# Altium schematic sheet CherryPi.SchDoc
size A2; SheetNumber: 1; SheetTotal: 1
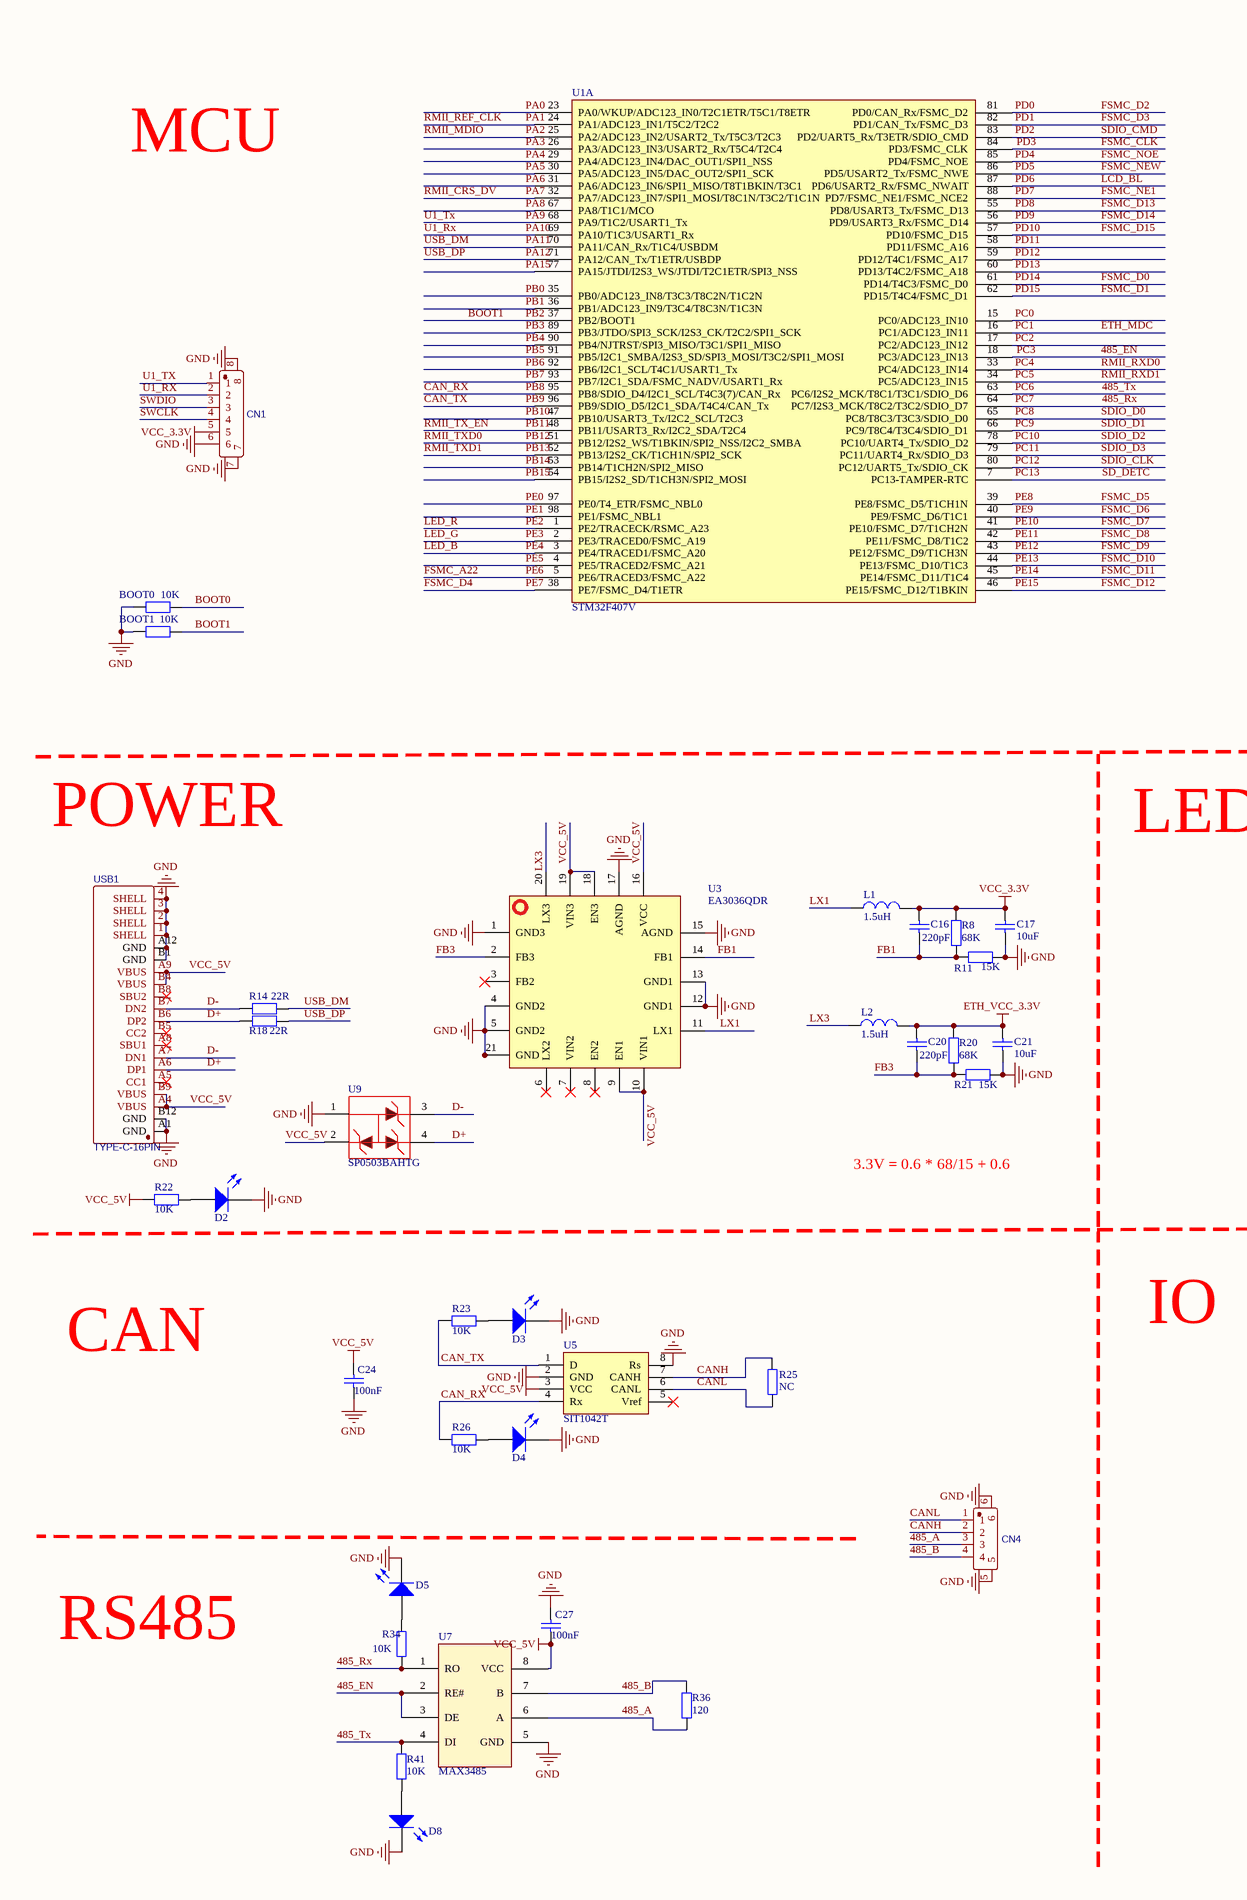
[diagram p0: CherryPi.SchDoc, left]
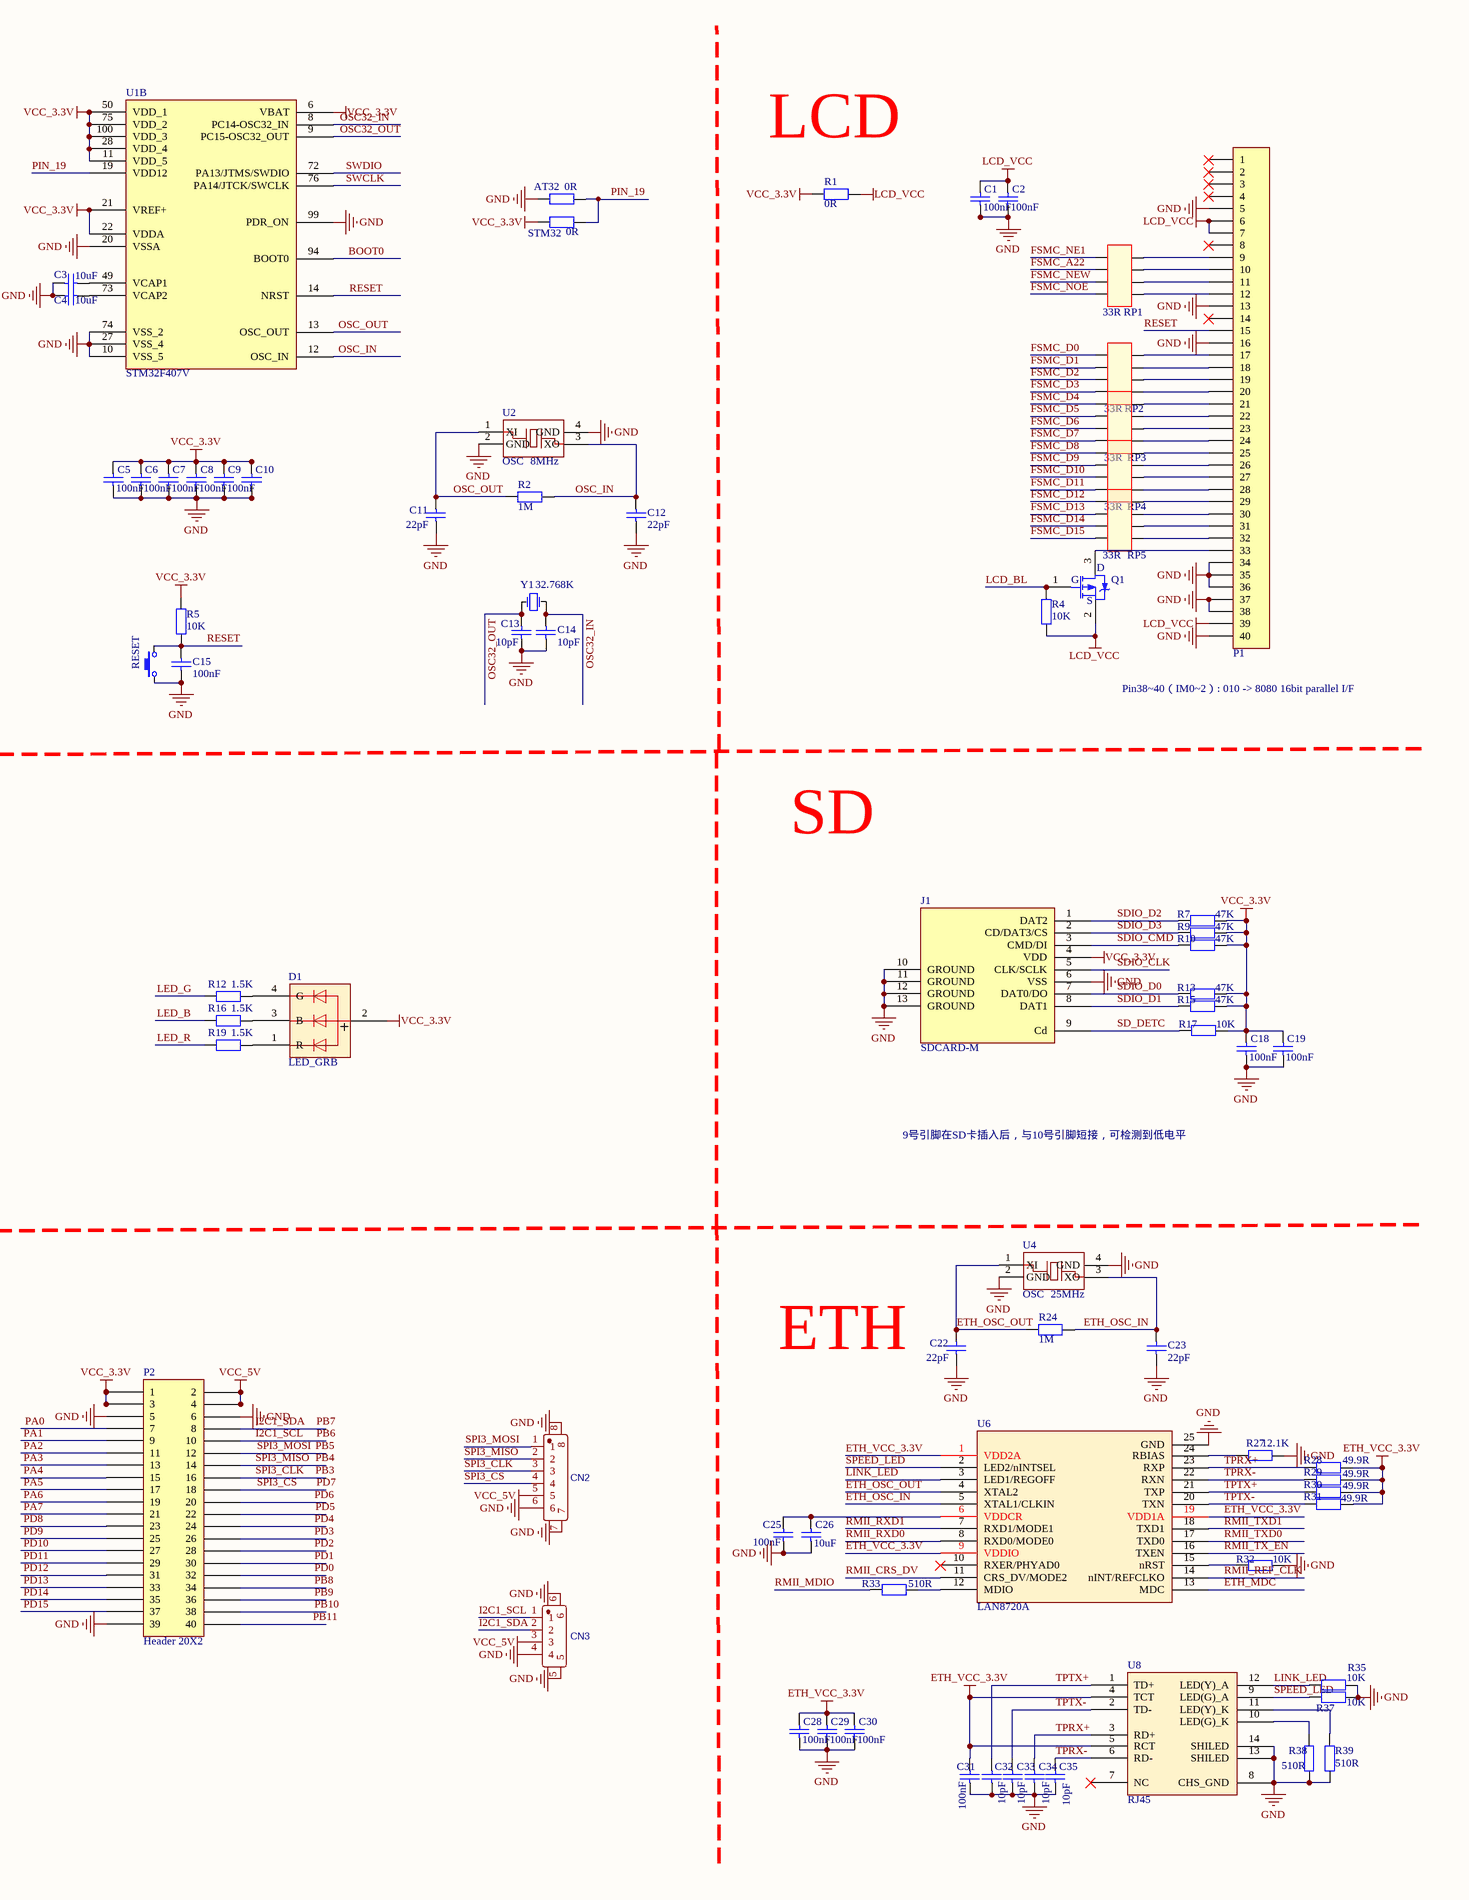
[diagram p1: CherryPi.SchDoc, right]

## Parts
AT32  value 0R  [0402_R - M]  (hidden comment: Res1)
BOOT0  value 10K  [0402_R - M]  (hidden comment: Res1)
BOOT1  value 10K  [0402_R - M]  (hidden comment: Res1)
C1  value 100nF  [0603_C]  (hidden comment: Cap)
C2  value 100nF  [0603_C]  (hidden comment: Cap)
C3  value 10uF  [0603_C]  (hidden comment: Cap)
C4  value 10uF  [0603_C]  (hidden comment: Cap)
C5  value 100nF  [0603_C]  (hidden comment: Cap)
C6  value 100nF  [0603_C]  (hidden comment: Cap)
C7  value 100nF  [0603_C]  (hidden comment: Cap)
C8  value 100nF  [0603_C]  (hidden comment: Cap)
C9  value 100nF  [0603_C]  (hidden comment: Cap)
C10  Cap  [0603_C]  (value not drawn)
C11  value 22pF  [0603_C]  (hidden comment: Cap)
C12  value 22pF  [0603_C]  (hidden comment: Cap)
C13  value 10pF  [0603_C]  (hidden comment: Cap)
C14  value 10pF  [0603_C]  (hidden comment: Cap)
C15  value 100nF  [0603_C]  (hidden comment: Cap)
C16  value 220pF  [0603_C]  (hidden comment: Cap)
C17  value 10uF  [0603_C]  (hidden comment: Cap)
C18  value 100nF  [0603_C]  (hidden comment: Cap)
C19  value 100nF  [0603_C]  (hidden comment: Cap)
C20  value 220pF  [0603_C]  (hidden comment: Cap)
C21  value 10uF  [0603_C]  (hidden comment: Cap)
C22  value 22pF  [0603_C]  (hidden comment: Cap)
C23  value 22pF  [0603_C]  (hidden comment: Cap)
C24  value 100nF  [0603_C]  (hidden comment: Cap)
C25  value 100nF  [0603_C]  (hidden comment: Cap)
C26  value 10uF  [0603_C]  (hidden comment: Cap)
C27  value 100nF  [0603_C]  (hidden comment: Cap)
C28  value 100nF  [0603_C]  (hidden comment: Cap)
C29  value 100nF  [0603_C]  (hidden comment: Cap)
C30  value 100nF  [0603_C]  (hidden comment: Cap)
C31  value 100nF  [0603_C]  (hidden comment: Cap)
C32  value 10pF  [0603_C]  (hidden comment: Cap)
C33  value 10pF  [0603_C]  (hidden comment: Cap)
C34  value 10pF  [0603_C]  (hidden comment: Cap)
C35  value 10pF  [0603_C]  (hidden comment: Cap)
CN1  WAFER-SH1.0-6PWB  [SH1.0_6P]  (value not drawn)
CN2  WAFER-SH1.0-6PWB  [SH1.0_6P]  (value not drawn)
CN3  HDGC1002WR-S-4P  [SH1.0_4P]  (value not drawn)
CN4  HDGC1002WR-S-4P  [SH1.0_4P]  (value not drawn)
D1  LED_GRB  [LED_RGB]
D2  LED0  [led-0603]  (value not drawn)
D3  LED0  [led-0603]  (value not drawn)
D4  LED0  [led-0603]  (value not drawn)
D5  LED0  [led-0603]  (value not drawn)
D8  LED0  [led-0603]  (value not drawn)
J1  SDCARD-M  [TF-SMD_503398-1892]
L1  value 1.5uH  [0805_L]  (hidden comment: Inductor)
L2  value 1.5uH  [0805_L]  (hidden comment: Inductor)
P1  Header 40  [FPC0.5 2H-WS-40P]  (value not drawn)
P2  Header 20X2  [HDR20X2_2.54]
Q1  MOSFET-P  [SOT-23]  (value not drawn)
R1  value 0R  [0603_R]  (hidden comment: Res1)
R2  value 1M  [0603_R]  (hidden comment: Res1)
R4  value 10K  [0603_R]  (hidden comment: Res1)
R5  value 10K  [0603_R]  (hidden comment: Res1)
R7  value 47K  [0603_R]  (hidden comment: Res1)
R8  value 68K  [0603_R]  (hidden comment: Res1)
R9  value 47K  [0603_R]  (hidden comment: Res1)
R10  value 47K  [0603_R]  (hidden comment: Res1)
R11  value 15K  [0603_R]  (hidden comment: Res1)
R12  value 1.5K  [0402_R - M]  (hidden comment: Res1)
R13  value 47K  [0603_R]  (hidden comment: Res1)
R14  value 22R  [0402_R - M]
R15  value 47K  [0603_R]  (hidden comment: Res1)
R16  value 1.5K  [0402_R - M]  (hidden comment: Res1)
R17  value 10K  [0603_R]  (hidden comment: Res1)
R18  value 22R  [0402_R - M]
R19  value 1.5K  [0402_R - M]  (hidden comment: Res1)
R20  value 68K  [0603_R]  (hidden comment: Res1)
R21  value 15K  [0603_R]  (hidden comment: Res1)
R22  value 10K  [0603_R]  (hidden comment: Res1)
R23  value 10K  [0603_R]
R24  value 1M  [0603_R]  (hidden comment: Res1)
R25  value NC  [0603_R]  (hidden comment: Res1)
R26  value 10K  [0603_R]
R27  value 12.1K  [0603_R]
R28  value 49.9R  [0603_R]
R29  value 49.9R  [0603_R]
R30  value 49.9R  [0603_R]
R31  value 49.9R  [0603_R]
R32  value 10K  [0603_R]
R33  value 510R  [0603_R]
R34  value 10K  [0603_R]
R35  value 10K  [0603_R]
R36  value 120  [0603_R]
R37  value 10K  [0603_R]
R38  value 510R  [0603_R]
R39  value 510R  [0603_R]
R41  value 10K  [0603_R]
RESET  TACT 2P  [SW-SMD_2*4]  (value not drawn)
RP1  33R  [0603_R(2x4)]
RP2  33R  [0603_R(2x4)]
RP3  33R  [0603_R(2x4)]
RP4  33R  [0603_R(2x4)]
RP5  33R  [0603_R(2x4)]
STM32  value 0R  [0402_R - M]  (hidden comment: Res1)
U1  STM32F407V  [LQFP-100_M]  (parts A,B of 2)
U2  OSC  [SMD_3225_4P]
U3  EA3036QDR  [QFN-20]
U4  OSC  [SMD_3225_4P]
U5  SIT1042T  [NSO8_N]
U6  LAN8720A  [QFN-24]
U7  MAX3485  [SOIC8_N]
U8  RJ45  [RJ45]
U9  SP0503BAHTG  [SOT_143]
USB1  TYPE-C-16PIN  [Type-C-16Pin]
Y1  value 32.768K  [SMD-3215]  (hidden comment: XTAL)

## Nets
ETH_VCC_3.3V: C20.2 C21.2 C28.1 C29.1 C30.1 C31.1 L2.2 R20.2 R28.1 R29.1 R30.1 R31.1 U6.1(VDD2A) U6.9(VDDIO) U6.19(VDD1A) U8.4(TCT) U8.5(RCT)
GND: AT32.2 BOOT0.1 BOOT1.1 C1.2 C2.2 C3.1 C4.1 C5.2 C6.2 C7.2 C8.2 C9.2 C10.2 C11.1 C12.1 C13.2 C14.1 C15.1 C17.1 C18.2 C19.2 C21.1 C22.1 C23.1 C24.2 C25.2 C26.2 C27.1 C28.2 C29.2 C30.2 C31.2 C32.2 C33.2 C34.2 C35.2 CN1.6 CN1.7 CN1.8 CN2.6 CN2.7 CN2.8 CN3.4 CN3.5 CN3.6 CN4.5 CN4.6 D2.2(K) D3.2(K) D4.2(K) D5.2(K) D8.2(K) J1.6(VSS) J1.10(GROUND) J1.11(GROUND) J1.12(GROUND) J1.13(GROUND) P1.5 P1.13 P1.16 P1.34 P1.35 P1.36 P1.37 P1.38 P1.40 P2.5 P2.6 P2.39 R11.1 R21.1 R27.1 R32.1 R35.1 R37.2 R38.2 R39.1 RESET.1 U1.10(VSS_5) U1.20(VSSA) U1.27(VSS_4) U1.74(VSS_2) U1.99(PDR_ON) U2.2(GND) U2.4(GND) U3.1(GND3) U3.4(GND2) U3.5(GND2) U3.12(GND1) U3.13(GND1) U3.15(AGND) U3.17(AGND) U3.21(GND) U4.2(GND) U4.4(GND) U5.2(GND) U5.8(Rs) U6.25(GND) U7.5(GND) U8.8(CHS_GND) U8.13(SHILED) U8.14(SHILED) U9.1(GND) USB1.1(SHELL) USB1.2(SHELL) USB1.3(SHELL) USB1.4(SHELL) USB1.A1(GND) USB1.A12(GND) USB1.B1(GND) USB1.B12(GND)
LCD_VCC: C1.1 C2.1 P1.6 P1.7 P1.39 Q1.2(S) R1.1 R4.1
VCC_3.3V: C5.1 C6.1 C7.1 C8.1 C9.1 C10.1 C16.2 C17.2 C18.1 C19.1 CN1.5 D1.2 J1.4(VDD) L1.2 P2.1 P2.3 R1.2 R5.1 R7.1 R8.2 R9.1 R10.1 R13.1 R15.1 R17.1 STM32.2 U1.6(VBAT) U1.11(VDD_5) U1.21(VREF+) U1.22(VDDA) U1.28(VDD_4) U1.50(VDD_1) U1.75(VDD_2) U1.100(VDD_3)
VCC_5V: C24.1 C27.2 CN2.5 CN3.3 P2.2 P2.4 R22.2 U3.9(EN1) U3.10(VIN1) U3.16(VCC) U3.18(EN3) U3.19(VIN3) U5.3(VCC) U7.8(VCC) U9.2 USB1.A4(VBUS) USB1.A9(VBUS) USB1.B4(VBUS) USB1.B9(VBUS)
485_A: CN4.3 R36.1 U7.6(A)
485_B: CN4.4 R36.2 U7.7(B)
485_EN: U1.18(PC3/ADC123_IN13) U7.2(RE#) U7.3(DE)  [also labelled PC3]
485_Rx: R34.2 U1.64(PC7/I2S3_MCK/T8C2/T3C2/SDIO_D7) U7.1(RO)  [also labelled PC7]
485_Tx: R41.2 U1.63(PC6/I2S2_MCK/T8C1/T3C1/SDIO_D6) U7.4(DI)  [also labelled PC6]
BOOT0: BOOT0.2 U1.94(BOOT0)
BOOT1: BOOT1.2 U1.37(PB2/BOOT1)  [also labelled PB2]
CAN_RX: P2.34 R26.2 U1.95(PB8/SDIO_D4/I2C1_SCL/T4C3(7)/CAN_Rx) U5.4(Rx)  [also labelled PB8]
CAN_TX: P2.36 R23.2 U1.96(PB9/SDIO_D5/I2C1_SDA/T4C4/CAN_Tx) U5.1(D)  [also labelled PB9]
CANH: CN4.2 R25.1 U5.7(CANH)
CANL: CN4.1 R25.2 U5.6(CANL)
D+: R18.1 U9.4 USB1.A6(DP1) USB1.B6(DP2)
D-: R14.1 U9.3 USB1.A7(DN1) USB1.B7(DN2)
ETH_MDC: U1.16(PC1/ADC123_IN11) U6.13(MDC)  [also labelled PC1]
ETH_OSC_IN: C23.2 R24.2 U4.3(XO) U6.5(XTAL1/CLKIN)
ETH_OSC_OUT: C22.2 R24.1 U4.1(XI) U6.4(XTAL2)
FB1: C16.1 R8.1 R11.2 U3.14(FB1)
FB3: C20.1 R20.1 R21.2 U3.2(FB3)
FSMC_A22: RP1.3 U1.5(PE6/TRACED3/FSMC_A22)  [also labelled PE6]
FSMC_CLK: P2.26 U1.84(PD3/FSMC_CLK)  [also labelled PD3]
FSMC_D0: P2.35 RP2.1 U1.61(PD14/T4C3/FSMC_D0)  [also labelled PD14]
FSMC_D1: P2.37 RP2.3 U1.62(PD15/T4C4/FSMC_D1)  [also labelled PD15]
FSMC_D2: P2.32 RP2.5 U1.81(PD0/CAN_Rx/FSMC_D2)  [also labelled PD0]
FSMC_D3: P2.30 RP2.7 U1.82(PD1/CAN_Tx/FSMC_D3)  [also labelled PD1]
FSMC_D4: RP3.1 U1.38(PE7/FSMC_D4/T1ETR)  [also labelled PE7]
FSMC_D5: RP3.3 U1.39(PE8/FSMC_D5/T1CH1N)  [also labelled PE8]
FSMC_D6: RP3.5 U1.40(PE9/FSMC_D6/T1C1)  [also labelled PE9]
FSMC_D7: RP3.7 U1.41(PE10/FSMC_D7/T1CH2N)  [also labelled PE10]
FSMC_D8: RP4.1 U1.42(PE11/FSMC_D8/T1C2)  [also labelled PE11]
FSMC_D9: RP4.3 U1.43(PE12/FSMC_D9/T1CH3N)  [also labelled PE12]
FSMC_D10: RP4.5 U1.44(PE13/FSMC_D10/T1C3)  [also labelled PE13]
FSMC_D11: RP4.7 U1.45(PE14/FSMC_D11/T1C4)  [also labelled PE14]
FSMC_D12: RP5.1 U1.46(PE15/FSMC_D12/T1BKIN)  [also labelled PE15]
FSMC_D13: P2.23 RP5.3 U1.55(PD8/USART3_Tx/FSMC_D13)  [also labelled PD8]
FSMC_D14: P2.25 RP5.5 U1.56(PD9/USART3_Rx/FSMC_D14)  [also labelled PD9]
FSMC_D15: P2.27 RP5.7 U1.57(PD10/FSMC_D15)  [also labelled PD10]
FSMC_NE1: CN2.4 P2.18 RP1.1 U1.88(PD7/FSMC_NE1/FSMC_NCE2)  [also labelled PD7, SPI3_CS]
FSMC_NEW: P2.22 RP1.5 U1.86(PD5/USART2_Tx/FSMC_NWE)  [also labelled PD5]
FSMC_NOE: P2.24 RP1.7 U1.85(PD4/FSMC_NOE)  [also labelled PD4]
I2C1_SCL: CN3.1 P2.10 U1.92(PB6/I2C1_SCL/T4C1/USART1_Tx)  [also labelled PB6]
I2C1_SDA: CN3.2 P2.8 U1.93(PB7/I2C1_SDA/FSMC_NADV/USART1_Rx)  [also labelled PB7]
LCD_BL: P2.20 Q1.1(G) R4.2 U1.87(PD6/USART2_Rx/FSMC_NWAIT)  [also labelled PD6]
LED_B: R16.1 U1.3(PE4/TRACED1/FSMC_A20)  [also labelled PE4]
LED_G: R12.1 U1.2(PE3/TRACED0/FSMC_A19)  [also labelled PE3]
LED_R: R19.1 U1.1(PE2/TRACECK/RSMC_A23)  [also labelled PE2]
LINK_LED: R35.2 U6.3(LED1/REGOFF) U8.12(LED(Y)_A)
LX1: L1.1 U3.11(LX1)
LX3: L2.1 U3.20(LX3)
OSC32_IN: C14.2 U1.8(PC14-OSC32_IN) Y1.2(OSC2)
OSC32_OUT: C13.1 U1.9(PC15-OSC32_OUT) Y1.1(OSC1)
OSC_IN: C12.2 R2.2 U1.12(OSC_IN) U2.3(XO)
OSC_OUT: C11.2 R2.1 U1.13(OSC_OUT) U2.1(XI)
PA0: P2.7 U1.23(PA0/WKUP/ADC123_IN0/T2C1ETR/T5C1/T8ETR)
PA1: P2.9 U1.24(PA1/ADC123_IN1/T5C2/T2C2) U6.14(nINT/REFCLKO)  [also labelled RMII_REF_CLK]
PA2: P2.11 R33.2 U1.25(PA2/ADC123_IN2/USART2_Tx/T5C3/T2C3)  [also labelled RMII_MDIO]
PA3: P2.13 U1.26(PA3/ADC123_IN3/USART2_Rx/T5C4/T2C4)
PA4: P2.15 U1.29(PA4/ADC123_IN4/DAC_OUT1/SPI1_NSS)
PA5: P2.17 U1.30(PA5/ADC123_IN5/DAC_OUT2/SPI1_SCK)
PA6: P2.19 U1.31(PA6/ADC123_IN6/SPI1_MISO/T8T1BKIN/T3C1)
PA7: P2.21 U1.32(PA7/ADC123_IN7/SPI1_MOSI/T8C1N/T3C2/T1C1N) U6.11(CRS_DV/MODE2)  [also labelled RMII_CRS_DV]
PA8: U1.67(PA8/T1C1/MCO)
PA9: CN1.1 U1.68(PA9/T1C2/USART1_Tx)  [also labelled U1_TX]
PA10: CN1.2 U1.69(PA10/T1C3/USART1_Rx)  [also labelled U1_RX]
PA11: R14.2 U1.70(PA11/CAN_Rx/T1C4/USBDM)  [also labelled USB_DM]
PA12: R18.2 U1.71(PA12/CAN_Tx/T1ETR/USBDP)  [also labelled USB_DP]
PA15: U1.77(PA15/JTDI/I2S3_WS/JTDI/T2C1ETR/SPI3_NSS)
PB0: U1.35(PB0/ADC123_IN8/T3C3/T8C2N/T1C2N)
PB1: U1.36(PB1/ADC123_IN9/T3C4/T8C3N/T1C3N)
PB3: CN2.3 P2.16 U1.89(PB3/JTDO/SPI3_SCK/I2S3_CK/T2C2/SPI1_SCK)  [also labelled SPI3_CLK]
PB4: CN2.2 P2.14 U1.90(PB4/NJTRST/SPI3_MISO/T3C1/SPI1_MISO)  [also labelled SPI3_MISO]
PB5: CN2.1 P2.12 U1.91(PB5/I2C1_SMBA/I2S3_SD/SPI3_MOSI/T3C2/SPI1_MOSI)  [also labelled SPI3_MOSI]
PB10: P2.38 U1.47(PB10/USART3_Tx/I2C2_SCL/T2C3)
PB11: P2.40 U1.48(PB11/USART3_Rx/I2C2_SDA/T2C4) U6.16(TXEN)  [also labelled RMII_TX_EN]
PB12: U1.51(PB12/I2S2_WS/T1BKIN/SPI2_NSS/I2C2_SMBA) U6.17(TXD0)  [also labelled RMII_TXD0]
PB13: U1.52(PB13/I2S2_CK/T1CH1N/SPI2_SCK) U6.18(TXD1)  [also labelled RMII_TXD1]
PB14: U1.53(PB14/T1CH2N/SPI2_MISO)
PB15: U1.54(PB15/I2S2_SD/T1CH3N/SPI2_MOSI)
PC0: U1.15(PC0/ADC123_IN10)
PC2: U1.17(PC2/ADC123_IN12)
PC4: U1.33(PC4/ADC123_IN14) U6.8(RXD0/MODE0)  [also labelled RMII_RXD0]
PC5: U1.34(PC5/ADC123_IN15) U6.7(RXD1/MODE1)  [also labelled RMII_RXD1]
PC8: J1.7(DAT0/DO) R13.2 U1.65(PC8/T8C3/T3C3/SDIO_D0)  [also labelled SDIO_D0]
PC9: J1.8(DAT1) R15.2 U1.66(PC9/T8C4/T3C4/SDIO_D1)  [also labelled SDIO_D1]
PC10: J1.1(DAT2) R7.2 U1.78(PC10/UART4_Tx/SDIO_D2)  [also labelled SDIO_D2]
PC11: J1.2(CD/DAT3/CS) R9.2 U1.79(PC11/UART4_Rx/SDIO_D3)  [also labelled SDIO_D3]
PC12: J1.5(CLK/SCLK) U1.80(PC12/UART5_Tx/SDIO_CK)  [also labelled SDIO_CLK]
PC13: J1.9(Cd) R17.2 U1.7(PC13-TAMPER-RTC)  [also labelled SD_DETC]
PD2: J1.3(CMD/DI) P2.28 R10.2 U1.83(PD2/UART5_Rx/T3ETR/SDIO_CMD)  [also labelled SDIO_CMD]
PD11: P2.29 U1.58(PD11/FSMC_A16)
PD12: P2.31 U1.59(PD12/T4C1/FSMC_A17)
PD13: P2.33 U1.60(PD13/T4C2/FSMC_A18)
PE0: U1.97(PE0/T4_ETR/FSMC_NBL0)
PE1: U1.98(PE1/FSMC_NBL1)
PE5: U1.4(PE5/TRACED2/FSMC_A21)
PIN_19: AT32.1 STM32.1 U1.19(VDD12)
RESET: C15.2 P1.15 R5.2 RESET.2 U1.14(NRST)
SPEED_LED: R37.1 U6.2(LED2/nINTSEL) U8.9(LED(G)_A)
SWCLK: CN1.4 U1.76(PA14/JTCK/SWCLK)
SWDIO: CN1.3 U1.72(PA13/JTMS/SWDIO)
TPRX+: C34.1 R28.2 U6.23(RXP) U8.3(RD+)
TPRX-: C35.1 R29.2 U6.22(RXN) U8.6(RD-)
TPTX+: C32.1 R30.2 U6.21(TXP) U8.1(TD+)
TPTX-: C33.1 R31.2 U6.20(TXN) U8.2(TD-)
NetC3_2: C3.2 U1.49(VCAP1)
NetC4_2: C4.2 U1.73(VCAP2)
NetC25_1: C25.1 C26.1 U6.6(VDDCR)
NetD1_1: D1.1(R) R19.2
NetD1_3: D1.3(B) R16.2
NetD1_4: D1.4(G) R12.2
NetD2_1: D2.1(A) R22.1
NetD3_1: D3.1(A) R23.1
NetD4_1: D4.1(A) R26.1
NetD5_1: D5.1(A) R34.1
NetD8_1: D8.1(A) R41.1
NetP1_9: P1.9 RP1.2
NetP1_10: P1.10 RP1.4
NetP1_11: P1.11 RP1.6
NetP1_12: P1.12 RP1.8
NetP1_17: P1.17 RP2.2
NetP1_18: P1.18 RP2.4
NetP1_19: P1.19 RP2.6
NetP1_20: P1.20 RP2.8
NetP1_21: P1.21 RP3.2
NetP1_22: P1.22 RP3.4
NetP1_23: P1.23 RP3.6
NetP1_24: P1.24 RP3.8
NetP1_25: P1.25 RP4.2
NetP1_26: P1.26 RP4.4
NetP1_27: P1.27 RP4.6
NetP1_28: P1.28 RP4.8
NetP1_29: P1.29 RP5.2
NetP1_30: P1.30 RP5.4
NetP1_31: P1.31 RP5.6
NetP1_32: P1.32 RP5.8
NetP1_33: P1.33 Q1.3(D)
NetR27_2: R27.2 U6.24(RBIAS)
NetR32_2: R32.2 U6.15(nRST)
NetR33_1: R33.1 U6.12(MDIO)
NetR38_1: R38.1 U8.10(LED(G)_K)
NetR39_2: R39.2 U8.11(LED(Y)_K)

Not connected (* = marked no-connect by the designer): P1 1* 2* 3* 4* 8* 14*; U3 3(FB2)* 6(LX2)* 7(VIN2)* 8(EN2)*; U5 5(Vref)*; U6 10(RXER/PHYAD0)*; U8 7(NC)*; USB1 A5(CC1)* A8(SBU1)* B5(CC2)* B8(SBU2)*

## Notes on the sheet
- (near R1) LCD
- MCU
- (near U2) 8MHz
- (near P1) Pin38~40（IM0~2）: 010 -> 8080 16bit parallel I/F
- POWER
- LED
- SD
- 3.3V = 0.6 * 68/15 + 0.6
- 9号引脚在SD卡插入后，与10号引脚短接，可检测到低电平
- (near U4) 25MHz
- CAN
- IO
- ETH
- RS485

## Library data of the parts
AT32 BOOT0 BOOT1 R2 R4 R5 R8 R11 R20 R21 R24 STM32 = Res1: 贴片电阻; Published: 8-Jun-2000; LatestRevisionDate: 17-Jul-2002; LatestRevisionNote: Re-released for DXP Platform.; PackageReference: AXIAL-0.4; Publisher: Altium Limited
C1-C10 C18 C19 C24-C35 = Cap: 无极性电容; Published: 8-Jun-2000; LatestRevisionDate: 17-Jul-2002; LatestRevisionNote: Re-released for DXP Platform.; PackageReference: RAD-0.3; Publisher: Altium Limited
C11-C17 C20-C23 = Cap: Capacitor; Published: 8-Jun-2000; LatestRevisionDate: 17-Jul-2002; LatestRevisionNote: Re-released for DXP Platform.; PackageReference: RAD-0.3; Publisher: Altium Limited; PackageDescription: Radial Cap, Thru-Hole; 2 Leads; 0.3 in Pin Spacing
CN1 CN2 = WAFER-SH1.0-6PWB: BOM_Manufacturer: XUNPU(讯普); Contributor: lcsc; BOM_Supplier: LCSC; BOM_Supplier Part: C3029345; BOM_Manufacturer Part: WAFER-SH1.0-6PWB; link: https://atta.szlcsc.com/upload/public/pdf/source/20220527/1879B8210BD3B2006BCEAC1A40D397B6.pdf; BOM_JLCPCB Part Class: Extended Part; spicePre: C; spiceSymbolName: WAFER-SH1.0-6PWB
CN3 CN4 = HDGC1002WR-S-4P: BOM_Manufacturer: HDGC(华德共创); Contributor: LCSC; BOM_Supplier: LCSC; BOM_Supplier Part: C2936214; BOM_Manufacturer Part: HDGC1002WR-S-4P; BOM_JLCPCB Part Class: Extended Part; spicePre: C; spiceSymbolName: HDGC1002WR-S-4P
D1 = LED_RGB: 共阳三色LED
D2-D5 D8 = LED0: 发光二极管; Published: 8-Jun-2000; LatestRevisionDate: 08-Jul-2005; LatestRevisionNote: Mech Layer 1 removed.; PackageReference: LED-0; Publisher: Altium Limited
J1 = SDCARD-M: TF卡槽
L1 L2 = Inductor: 电感; Code_IEC: 1005; Published: 8-Jun-2000; LatestRevisionDate: 17-Jul-2002; LatestRevisionNote: Re-released for DXP Platform.; PackageReference: 0402-A; Publisher: Altium Limited; Code_JEITA: 0402
P1 = Header 40: 接插件; LatestRevisionDate: 17-Jul-2002; LatestRevisionNote: Re-released for DXP Platform.; Publisher: Altium Limited
P2 = Header 20X2: 接插件; LatestRevisionDate: 17-Jul-2002; LatestRevisionNote: Re-released for DXP Platform.; Publisher: Altium Limited
Q1 = MOSFET-P: P-Channel MOSFET; PackageDocument: 1995/1996; Published: 8-Jun-2000; LatestRevisionDate: 17-Jul-2002; LatestRevisionNote: Re-released for DXP Platform.; PackageReference: E3; Publisher: Altium Limited
R1 R7 R9 R10 R12 R13 R15-R17 R19 R22 R25 = Res: 贴片电阻; Published: 8-Jun-2000; LatestRevisionDate: 17-Jul-2002; LatestRevisionNote: Re-released for DXP Platform.; PackageReference: AXIAL-0.4; Publisher: Altium Limited
R14 R18 R23 R26-R39 R41 = Res2: Resistor; Published: 8-Jun-2000; LatestRevisionDate: 17-Jul-2002; LatestRevisionNote: Re-released for DXP Platform.; PackageReference: AXIAL-0.4; Publisher: Altium Limited
RESET = ButtonTACT_3x4x2_180: Button; value: 3x4; type: TACT 2P
RP1-RP5 = R_pack
U1 = STM32F407V: STM32单片机100引脚
U2 U4 = SMD-2520: 四脚无源晶振
U3 = EA3036QDR: 3-channels power management IC
U5 = SN65HVD230: CAN芯片
U6 = LAN8720A: 以太网芯片
U7 = MAX3485: RS-485/RS-422芯片
U8 = RJ45: 以太网连接器
U9 = SP0503BAHTG: 3-channels ESD protection
USB1 = TYPE-C16PIN: BOM_Manufacturer: SHOU HAN; Contributor: LCSC; BOM_Supplier: LCSC; BOM_Supplier Part: C393939; BOM_Manufacturer Part: TYPE-C16PIN; spicePre: U; spiceSymbolName: TYPE-C16PIN
Y1 = XTAL: 晶振; Published: 8-Jun-2000; LatestRevisionDate: 17-Jul-2002; LatestRevisionNote: Re-released for DXP Platform.; PackageReference: R38; Publisher: Altium Limited